# EAGLE design Corner Board Rev1 (EAGLE 9.6.2)
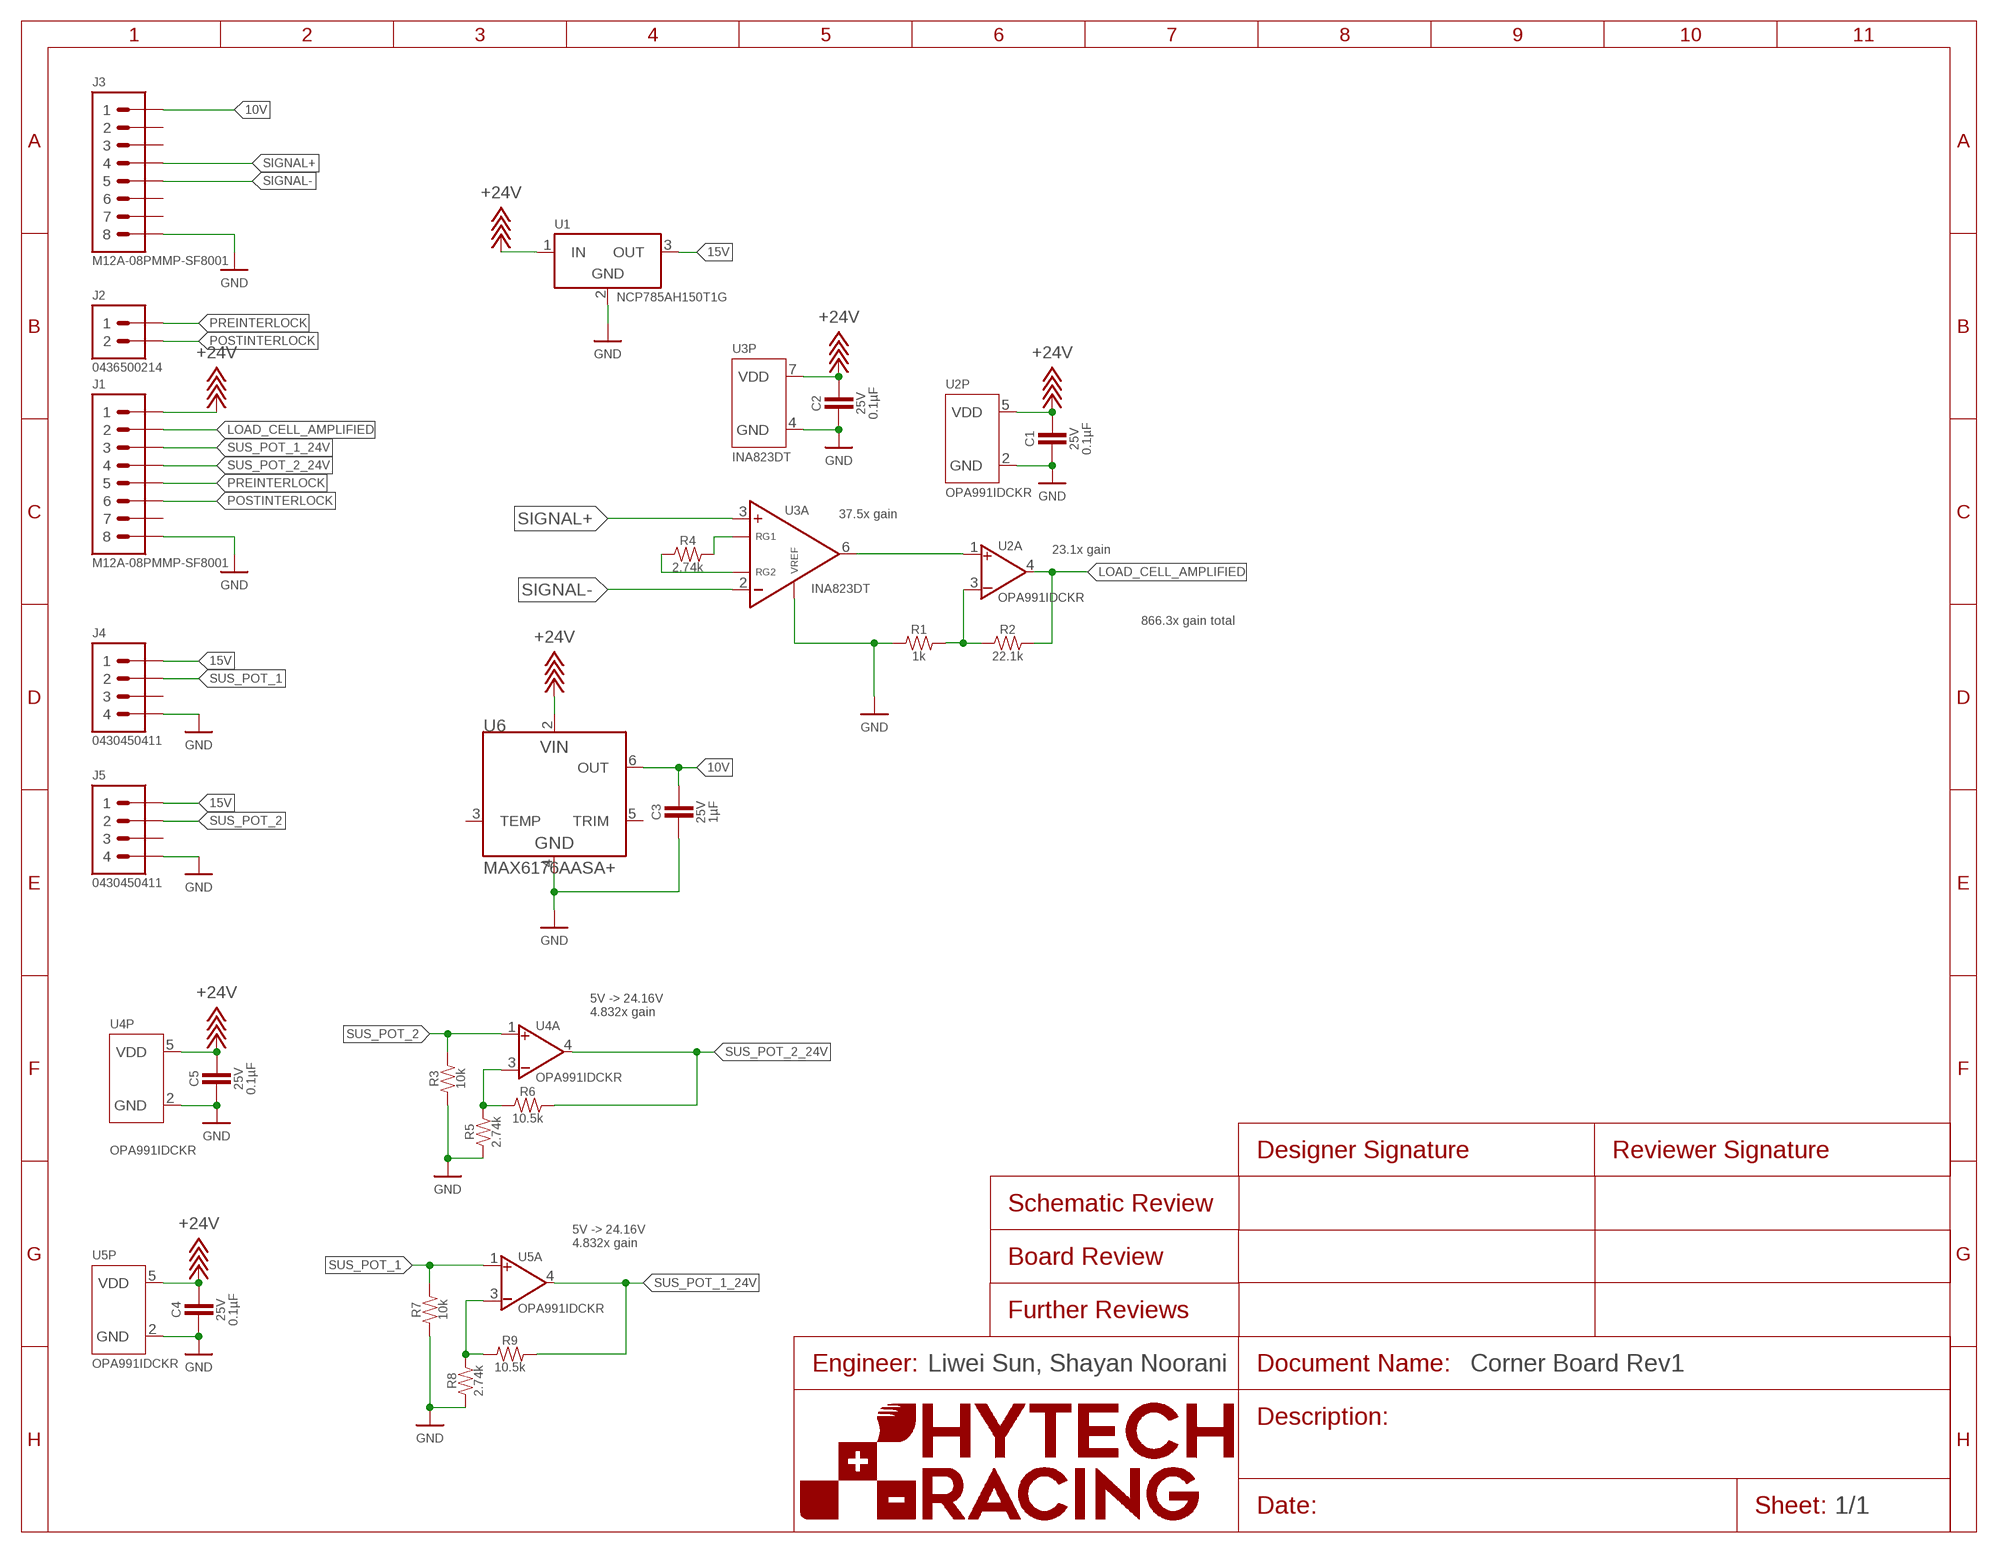
[diagram p0: schematic, sheet 1]
FRAME1 (FRAME): ENGINEER: Liwei Sun, Shayan Noorani

## Parts
C1  CAPACITOR_0603_25V_0.1UF  [0603-CAP]
C2  CAPACITOR_0603_25V_0.1UF  [0603-CAP]
C3  CAPACITOR_0603_25V_1UF  [0603-CAP]
C4  CAPACITOR_0603_25V_0.1UF  [0603-CAP]
C5  CAPACITOR_0603_25V_0.1UF  [0603-CAP]
J1  CONNECTOR-8_AMPHENOL_M12A_08PMMP_  [M12A-08PMMP]
J2  CONNECTOR-2_MICROFIT_SMD_RIGHTANGLE_02_SINGLE_BLACK  [MOLEX_MICROFIT_SMD_RIGHTANGLE_02_SINGLE]
J3  CONNECTOR-8_AMPHENOL_M12A_08PMMP_  [M12A-08PMMP]
J4  CONNECTOR-4_μF_S_RA_  [MOLEX_MICROFIT_SMD_RIGHTANGLE_04_DUAL]
J5  CONNECTOR-4_μF_S_RA_  [MOLEX_MICROFIT_SMD_RIGHTANGLE_04_DUAL]
R1  RESISTOR_0603_1K  [0603-RES]
R2  RESISTOR_0603_22.1K  [0603-RES]
R3  RESISTOR_0603_10K  [0603-RES]
R4  RESISTOR_0603_2.74K  [0603-RES]
R5  RESISTOR_0603_2.74K  [0603-RES]
R6  RESISTOR_0603_10.5K  [0603-RES]
R7  RESISTOR_0603_10K  [0603-RES]
R8  RESISTOR_0603_2.74K  [0603-RES]
R9  RESISTOR_0603_10.5K  [0603-RES]
U1  VOLTAGE_REGULATOR_SOT-89_15V  [SOT-89]
U2  OPAMP_1_CHANNEL_OPA991  [SC-70-5]
U3  INA823DT  [SOIC-08(NARROW,0.15")]
U4  OPAMP_1_CHANNEL_OPA991  [SC-70-5]
U5  OPAMP_1_CHANNEL_OPA991  [SC-70-5]
U6  VOLTAGE_REFERENCE__10V  [SOIC-08(NARROW,0.15")]

## Nets
10V: C3.1 J3.1 U6.6(OUT)
15V: J4.1 J5.1 U1.3(OUT)
+24V: C1.1 C2.1 C4.1 C5.1 J1.1 U1.1(IN) U2.5(P:VDD) U3.7(P:VDD) U4.5(P:VDD) U5.5(P:VDD) U6.2(VIN)
GND: C1.2 C2.2 C3.2 C4.2 C5.2 J1.8 J3.8 J4.4 J5.4 R1.1 R3.1 R5.1 U1.2(GND) U2.2(P:GND) U3.4(P:GND) U3.5(A:VREF) U4.2(P:GND) U5.2(P:GND) U6.4(GND)
LOAD_CELL_AMPLIFIED: J1.2 R2.2 U2.4(A:VOUT)
N$1: R1.2 R2.1 U2.3(A:VIN-)
N$2: R4.2 U3.1(A:RG1)
N$3: U2.1(A:VIN+) U3.6(A:VOUT)
N$4: R4.1 U3.8(A:RG2)
N$5: R5.2 R6.1 U4.3(A:VIN-)
N$7: R7.1 R8.1 ; supply symbol labelled GND
N$8: R8.2 R9.1 U5.3(A:VIN-)
POSTINTERLOCK: J1.6 J2.2
PREINTERLOCK: J1.5 J2.1
SIGNAL+: J3.4 U3.3(A:VIN+)
SIGNAL-: J3.5 U3.2(A:VIN-)
SUS_POT_1: J4.2 R7.2 U5.1(A:VIN+)
SUS_POT_1_24V: J1.3 R9.2 U5.4(A:VOUT)
SUS_POT_2: J5.2 R3.2 U4.1(A:VIN+)
SUS_POT_2_24V: J1.4 R6.2 U4.4(A:VOUT)
Unconnected: J1.7 J3.2 J3.3 J3.6 J3.7 J4.3 J5.3 U6.3(TEMP) U6.5(TRIM)

## Notes on the sheet
- 37.5x gain
- 23.1x gain
- 866.3x gain total
- 5V -> 24.16V
  4.832x gain
- 5V -> 24.16V
  4.832x gain

## Library data of the parts
C1 C2 C4 C5 = HyTechDevices:CAPACITOR_?_*: Capacitor, Non-Polarized VJ...1BC Series Datasheet <https://www.mouser.com/datasheet/2/427/vjw1bcbascomseries-1762447.pdf> Samsung Datasheet <https://www.mouser.com/datasheet/2/585/MLCC-1837944.pdf> Walsin Datasheet <https://www.mouser.com/datasheet/2/210/WTC_MLCC_General_Purpose-1534899.pdf> GRM188R61A226ME15D <https://www.mouser.com/datasheet/2/281/1/GRM188R61A226ME15_02A-1985787.pdf> GRM188R61E106MA73D <https://www.mouser.com/datasheet/2/281/1/GRM188R61E106MA73_01A-1985806.pdf> 885012006013 <https://www.mouser.com/datasheet/2/445/885012006013-1726946.pdf> 2220Y6300105KXTWS2 <https://www.mouser.com/datasheet/2/218/SMD_High_and_Std_StackiCap_P62-1825512.pdf> Yageo Class 2, X5R <https://www.mouser.com/datasheet/2/447/UPY_GPHC_X5R_4V_to_50V_26-1827097.pdf> TDK C Series <https://www.mouser.com/ProductDetail/TDK/C3216X5R1V226M160AC?qs=%2Fha2pyFadujbcx9jh7lYl%2F4NeMoXFhdc8AqVWNq4wW6M2y7zl6GzBuhgtI0ngznN> AVX Automotive MLCC <https://www.mouser.com/datasheet/2/40/AutoMLCC-777028.pdf> KEMET X7R Series <https://www.mouser.com/datasheet/2/212/KEM_C1002_X7R_SMD-1102033.pdf> Kyocera AVX <https://www.mouser.com/datasheet/2/40/C0GNP0_Dielectric-951274.pdf> GRM21BR61H <https://www.mouser.com/datasheet/2/281/1/GRM21BR61H106KE43_01A-1986884.pdf>; CAPACITANCE: 0.1µF; DKPN: 1276-1006-1-ND; MANUFACTURER: Samsung Electro-Mechanics; MOPN: 187-CL10B104KA8NNNC; MPN: CL10B104KA8NNNC; TOLERANCE: 10%; VOLTAGE: 25V
C3 = HyTechDevices:CAPACITOR_?_*: Capacitor, Non-Polarized VJ...1BC Series Datasheet <https://www.mouser.com/datasheet/2/427/vjw1bcbascomseries-1762447.pdf> Samsung Datasheet <https://www.mouser.com/datasheet/2/585/MLCC-1837944.pdf> Walsin Datasheet <https://www.mouser.com/datasheet/2/210/WTC_MLCC_General_Purpose-1534899.pdf> GRM188R61A226ME15D <https://www.mouser.com/datasheet/2/281/1/GRM188R61A226ME15_02A-1985787.pdf> GRM188R61E106MA73D <https://www.mouser.com/datasheet/2/281/1/GRM188R61E106MA73_01A-1985806.pdf> 885012006013 <https://www.mouser.com/datasheet/2/445/885012006013-1726946.pdf> 2220Y6300105KXTWS2 <https://www.mouser.com/datasheet/2/218/SMD_High_and_Std_StackiCap_P62-1825512.pdf> Yageo Class 2, X5R <https://www.mouser.com/datasheet/2/447/UPY_GPHC_X5R_4V_to_50V_26-1827097.pdf> TDK C Series <https://www.mouser.com/ProductDetail/TDK/C3216X5R1V226M160AC?qs=%2Fha2pyFadujbcx9jh7lYl%2F4NeMoXFhdc8AqVWNq4wW6M2y7zl6GzBuhgtI0ngznN> AVX Automotive MLCC <https://www.mouser.com/datasheet/2/40/AutoMLCC-777028.pdf> KEMET X7R Series <https://www.mouser.com/datasheet/2/212/KEM_C1002_X7R_SMD-1102033.pdf> Kyocera AVX <https://www.mouser.com/datasheet/2/40/C0GNP0_Dielectric-951274.pdf> GRM21BR61H <https://www.mouser.com/datasheet/2/281/1/GRM21BR61H106KE43_01A-1986884.pdf>; CAPACITANCE: 1µF; DKPN: 1276-1184-1-ND; MANUFACTURER: Samsung Electro-Mechanics; MOPN: 187-CL10B105KA8NNNC; MPN: CL10B105KA8NNNC; TOLERANCE: 10%; VOLTAGE: 25V
J1 J3 = HyTechDevices:CONNECTOR-8_?_*: 8 Pin Connector; DKPN: 1754-1026-ND; MANUFACTURER: Amphenol LTW; MOPN: 523-M12A08PMMPSF8001; MPN: M12A-08PMMP-SF8001
J2 = HyTechDevices:CONNECTOR-2_?_*: 2 Pin Connector; DKPN: WM14310CT-ND; MANUFACTURER: Molex; MOPN: 538-43650-0214; MPN: 0436500214
J4 J5 = HyTechDevices:CONNECTOR-4_?_*: 4 Pin Connector; DKPN: WM1832CT-ND; MANUFACTURER: Molex; MOPN: 538-0430450411; MPN: 0430450411
R1 = HyTechDevices:RESISTOR_?_*: Resistor PWR163 Series <https://www.mouser.com/datasheet/2/54/pwr163-777985.pdf> AC Series <https://www.mouser.com/datasheet/2/447/Yageo_PYu_AC_51_RoHS_L_7_1714230-1874691.pdf> PU Series <https://www.mouser.com/datasheet/2/447/PYu-PU_51_RoHS_L_6-1504619.pdf> ERA Series <https://www.mouser.com/datasheet/2/315/AOA0000C307-1149632.pdf> PWR263 Series <https://www.mouser.com/datasheet/2/54/pwr263s_35-778069.pdf> KTR Series <https://www.mouser.com/datasheet/2/348/ROHM_S_A0011075115_1-2563276.pdf> RC Series <https://www.mouser.com/datasheet/2/447/Yageo_03_18_2021_PYu_RC_Group_51_RoHS_L_11-2199992.pdf> ERJ PB3, PB6 Series <https://www.mouser.com/datasheet/2/315/AOA0000C328-1530132.pdf> ERJ PA2, P03, PA3, P06, P08, P14 Series <https://www.mouser.com/datasheet/2/315/AOA0000C331-1141874.pdf> B20 Series <https://www.ohmite.com/assets/docs/res_200.pdf?r=false> TE Connectivity/Holsworthy RN73 Series <https://www.mouser.com/datasheet/2/418/4/NG_DS_1773270_M-604713.pdf> Vishay Dale D/CRCW e3 <https://www.mouser.com/datasheet/2/427/dcrcwe3-1762152.pdf> Ohmite B20 <https://www.ohmite.com/assets/docs/res_200.pdf?r=false>; DKPN: 1712-CPF-A-0603B1K0ETR-ND; MANUFACTURER: TE Connectivity Passive Product; MOPN: 279-CPF-A-0603B1K0E; MPN: CPF-A-0603B1K0E; POWER: 0.0625W; RESISTANCE: 1k; TOLERANCE: 0.1%; VOLTAGE_CONTINUOUS: 7.9V; VOLTAGE_MAX: 50V
R2 = HyTechDevices:RESISTOR_?_*: Resistor PWR163 Series <https://www.mouser.com/datasheet/2/54/pwr163-777985.pdf> AC Series <https://www.mouser.com/datasheet/2/447/Yageo_PYu_AC_51_RoHS_L_7_1714230-1874691.pdf> PU Series <https://www.mouser.com/datasheet/2/447/PYu-PU_51_RoHS_L_6-1504619.pdf> ERA Series <https://www.mouser.com/datasheet/2/315/AOA0000C307-1149632.pdf> PWR263 Series <https://www.mouser.com/datasheet/2/54/pwr263s_35-778069.pdf> KTR Series <https://www.mouser.com/datasheet/2/348/ROHM_S_A0011075115_1-2563276.pdf> RC Series <https://www.mouser.com/datasheet/2/447/Yageo_03_18_2021_PYu_RC_Group_51_RoHS_L_11-2199992.pdf> ERJ PB3, PB6 Series <https://www.mouser.com/datasheet/2/315/AOA0000C328-1530132.pdf> ERJ PA2, P03, PA3, P06, P08, P14 Series <https://www.mouser.com/datasheet/2/315/AOA0000C331-1141874.pdf> B20 Series <https://www.ohmite.com/assets/docs/res_200.pdf?r=false> TE Connectivity/Holsworthy RN73 Series <https://www.mouser.com/datasheet/2/418/4/NG_DS_1773270_M-604713.pdf> Vishay Dale D/CRCW e3 <https://www.mouser.com/datasheet/2/427/dcrcwe3-1762152.pdf> Ohmite B20 <https://www.ohmite.com/assets/docs/res_200.pdf?r=false>; DKPN: P22.1KDBCT-ND; MANUFACTURER: Panasonic Electronic Components; MOPN: 667-ERA-3AEB2212V; MPN: ERA-3AEB2212V; POWER: 0.1W; RESISTANCE: 22.1k; TOLERANCE: 0.1%; VOLTAGE_CONTINUOUS: 47.01V; VOLTAGE_MAX: 75V
R3 R7 = HyTechDevices:RESISTOR_?_*: Resistor PWR163 Series <https://www.mouser.com/datasheet/2/54/pwr163-777985.pdf> AC Series <https://www.mouser.com/datasheet/2/447/Yageo_PYu_AC_51_RoHS_L_7_1714230-1874691.pdf> PU Series <https://www.mouser.com/datasheet/2/447/PYu-PU_51_RoHS_L_6-1504619.pdf> ERA Series <https://www.mouser.com/datasheet/2/315/AOA0000C307-1149632.pdf> PWR263 Series <https://www.mouser.com/datasheet/2/54/pwr263s_35-778069.pdf> KTR Series <https://www.mouser.com/datasheet/2/348/ROHM_S_A0011075115_1-2563276.pdf> RC Series <https://www.mouser.com/datasheet/2/447/Yageo_03_18_2021_PYu_RC_Group_51_RoHS_L_11-2199992.pdf> ERJ PB3, PB6 Series <https://www.mouser.com/datasheet/2/315/AOA0000C328-1530132.pdf> ERJ PA2, P03, PA3, P06, P08, P14 Series <https://www.mouser.com/datasheet/2/315/AOA0000C331-1141874.pdf> B20 Series <https://www.ohmite.com/assets/docs/res_200.pdf?r=false> TE Connectivity/Holsworthy RN73 Series <https://www.mouser.com/datasheet/2/418/4/NG_DS_1773270_M-604713.pdf> Vishay Dale D/CRCW e3 <https://www.mouser.com/datasheet/2/427/dcrcwe3-1762152.pdf> Ohmite B20 <https://www.ohmite.com/assets/docs/res_200.pdf?r=false>; DKPN: 311-10.0KHRCT-ND; MANUFACTURER: Yageo; MOPN: 603-RC0603FR-0710KL; MPN: RC0603FR-0710KL; POWER: 0.1W; RESISTANCE: 10k; TOLERANCE: 1%; VOLTAGE_CONTINUOUS: 31.62V; VOLTAGE_MAX: 75V
R4 R5 R8 = HyTechDevices:RESISTOR_?_*: Resistor PWR163 Series <https://www.mouser.com/datasheet/2/54/pwr163-777985.pdf> AC Series <https://www.mouser.com/datasheet/2/447/Yageo_PYu_AC_51_RoHS_L_7_1714230-1874691.pdf> PU Series <https://www.mouser.com/datasheet/2/447/PYu-PU_51_RoHS_L_6-1504619.pdf> ERA Series <https://www.mouser.com/datasheet/2/315/AOA0000C307-1149632.pdf> PWR263 Series <https://www.mouser.com/datasheet/2/54/pwr263s_35-778069.pdf> KTR Series <https://www.mouser.com/datasheet/2/348/ROHM_S_A0011075115_1-2563276.pdf> RC Series <https://www.mouser.com/datasheet/2/447/Yageo_03_18_2021_PYu_RC_Group_51_RoHS_L_11-2199992.pdf> ERJ PB3, PB6 Series <https://www.mouser.com/datasheet/2/315/AOA0000C328-1530132.pdf> ERJ PA2, P03, PA3, P06, P08, P14 Series <https://www.mouser.com/datasheet/2/315/AOA0000C331-1141874.pdf> B20 Series <https://www.ohmite.com/assets/docs/res_200.pdf?r=false> TE Connectivity/Holsworthy RN73 Series <https://www.mouser.com/datasheet/2/418/4/NG_DS_1773270_M-604713.pdf> Vishay Dale D/CRCW e3 <https://www.mouser.com/datasheet/2/427/dcrcwe3-1762152.pdf> Ohmite B20 <https://www.ohmite.com/assets/docs/res_200.pdf?r=false>; DKPN: P20020CT-ND; MANUFACTURER: Panasonic Electronic Components; MOPN: 667-ERJ-PB3B2741V; MPN: ERJ-PB3B2741V; POWER: 0.2W; RESISTANCE: 2.74k; TOLERANCE: 0.1%; VOLTAGE_CONTINUOUS: 23.41V; VOLTAGE_MAX: 150V
R6 R9 = HyTechDevices:RESISTOR_?_*: Resistor PWR163 Series <https://www.mouser.com/datasheet/2/54/pwr163-777985.pdf> AC Series <https://www.mouser.com/datasheet/2/447/Yageo_PYu_AC_51_RoHS_L_7_1714230-1874691.pdf> PU Series <https://www.mouser.com/datasheet/2/447/PYu-PU_51_RoHS_L_6-1504619.pdf> ERA Series <https://www.mouser.com/datasheet/2/315/AOA0000C307-1149632.pdf> PWR263 Series <https://www.mouser.com/datasheet/2/54/pwr263s_35-778069.pdf> KTR Series <https://www.mouser.com/datasheet/2/348/ROHM_S_A0011075115_1-2563276.pdf> RC Series <https://www.mouser.com/datasheet/2/447/Yageo_03_18_2021_PYu_RC_Group_51_RoHS_L_11-2199992.pdf> ERJ PB3, PB6 Series <https://www.mouser.com/datasheet/2/315/AOA0000C328-1530132.pdf> ERJ PA2, P03, PA3, P06, P08, P14 Series <https://www.mouser.com/datasheet/2/315/AOA0000C331-1141874.pdf> B20 Series <https://www.ohmite.com/assets/docs/res_200.pdf?r=false> TE Connectivity/Holsworthy RN73 Series <https://www.mouser.com/datasheet/2/418/4/NG_DS_1773270_M-604713.pdf> Vishay Dale D/CRCW e3 <https://www.mouser.com/datasheet/2/427/dcrcwe3-1762152.pdf> Ohmite B20 <https://www.ohmite.com/assets/docs/res_200.pdf?r=false>; DKPN: P10.5KDBCT-ND; MANUFACTURER: Panasonic Electronic Components; MOPN: 677-ERA-3AEB1052V; MPN: ERA-3AEB1052V; POWER: 0.1W; RESISTANCE: 10.5k; TOLERANCE: 0.1%; VOLTAGE_CONTINUOUS: 32.40V; VOLTAGE_MAX: 75V
U1 = HyTechDevices:VOLTAGE_REGULATOR_?_*: Voltage Regulators LDL1117S50R Datasheet <https://www.mouser.com/datasheet/2/389/dm00366442-1799212.pdf> NCP785AH120T1G <https://www.mouser.com/datasheet/2/308/NCP785A_D-1812704.pdf> LMS8117A Datasheet <https://www.ti.com/lit/ds/symlink/lms8117a.pdf?HQS> ST732M50R Datasheet <https://www.mouser.com/datasheet/2/389/st732-1830546.pdf> LM2937IMPX-10/NOPB Datasheet <https://www.ti.com/lit/ds/symlink/lm2937.pdf>; DKPN: NCP785AH150T1GOSTR-ND; MANUFACTURER: ON Semiconductor; MOPN: 863-NCP785AH150T1G; MPN: NCP785AH150T1G
U2 U4 U5 = HyTechDevices:OPAMP_1_CHANNEL_*: Op-Amp 1 Channel OPA991 Datasheet <https://www.ti.com/lit/ds/symlink/opa991.pdf?ts=1615503614502> Note: OPA991 is also a comparator; DKPN: 296-OPA991IDCKRCT-ND; MANUFACTURER: Texas Instruments; MOPN: 595-OPA991IDCKR; MPN: OPA991IDCKR
U3 = HyTechDevices:INA823*: INA823 Precision, Low-Power, Wide-Supply (2.7-V to 36-V) Instrumentation Amplifier Datasheet <https://www.ti.com/lit/ds/symlink/ina823.pdf?HQS=dis-mous-null-mousermode-dsf-pf-null-wwe&ts=1664732413637&ref_url=https%253A%252F%252Fwww.ti.com%252Fgeneral%252Fdocs%252Fsuppproductinfo.tsp%253FdistId%253D26%2526gotoUrl%253Dhttps%253A%252F%252Fwww.ti.com%252Flit%252Fgpn%252Fina823>; DKPN: 296-INA823DTCT-ND; MANUFACTURER: Texas Instruments; MOPN: 595-INA823DT; MPN: INA823DT
U6 = temp:VOLTAGE_REFERENCE_?_*: MAX6173–MAX6177 Datasheet <https://www.mouser.com/datasheet/2/256/MAX6173-MAX6177-1515925.pdf>; DKPN: MAX6176AASA+-ND; MANUFACTURER: Maxim Integrated; MOPN: 700-MAX6176AASA; MPN: MAX6176AASA+

## Board
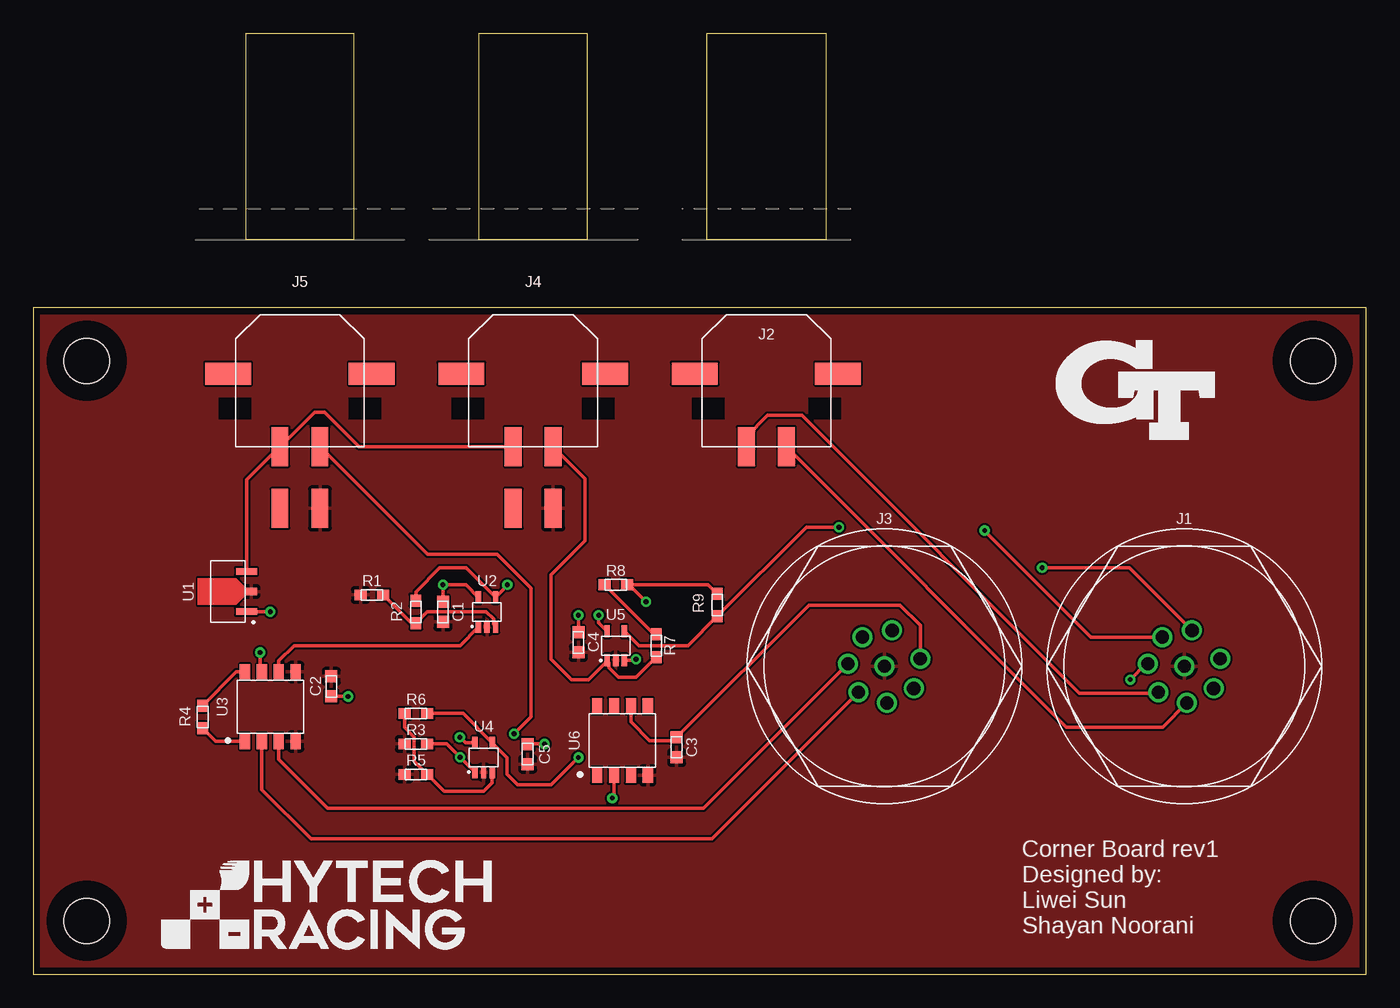
[diagram p1: board, top side]
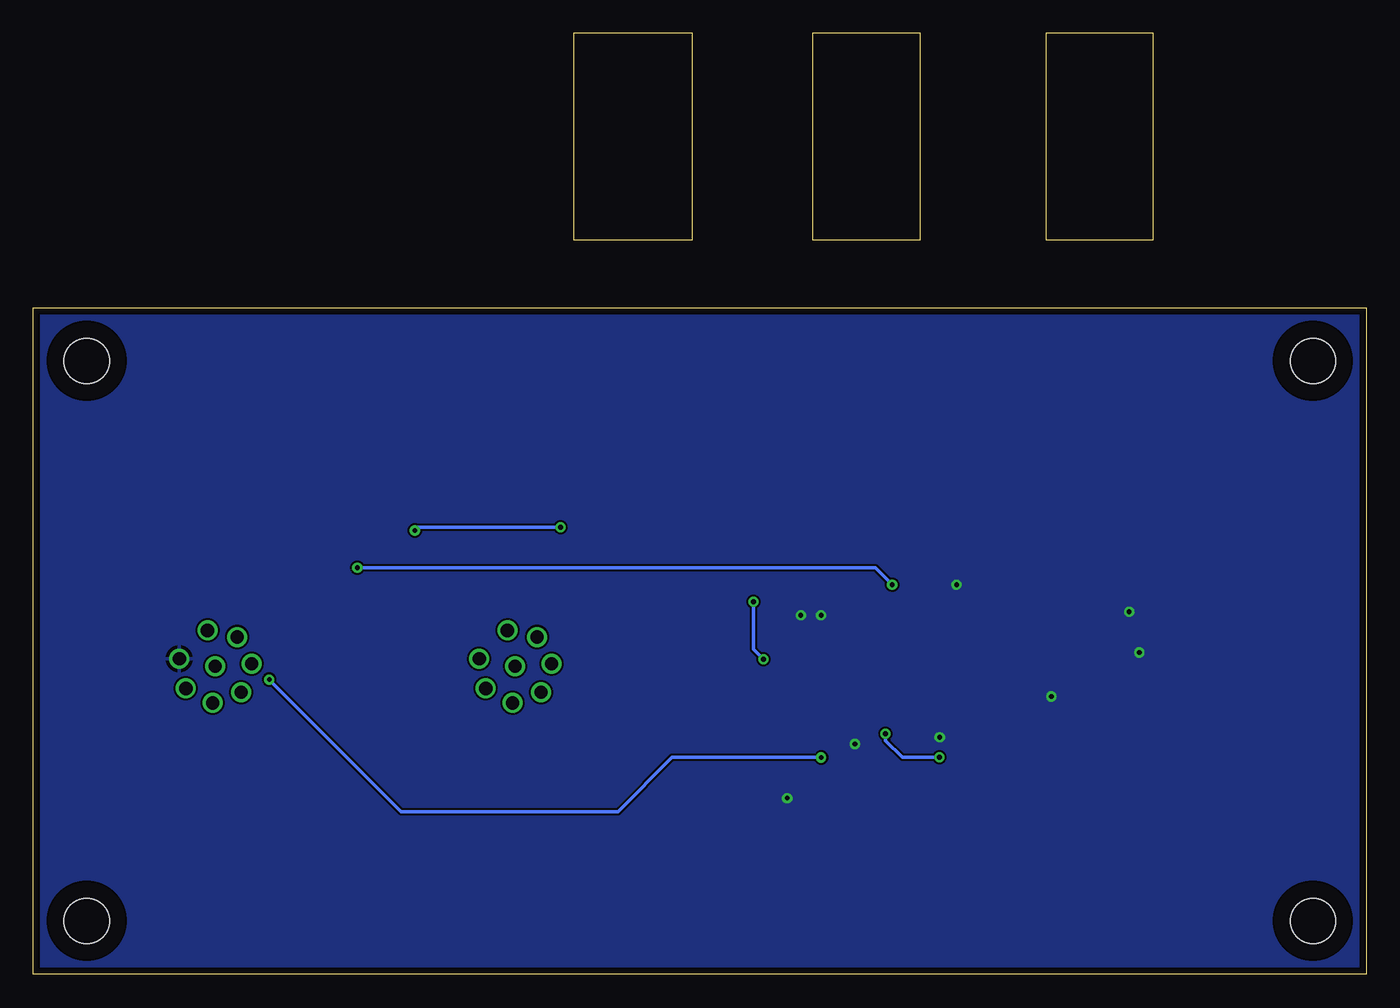
[diagram p2: board, bottom side, seen from below]

Size 100 x 50 mm. Coordinates in mm from the lower left corner, seen from the top.
Outline: 0,0 100,0 100,50 0,50 0,0
Copper layers (1*16): Top 0.035mm / dielectric 1.53mm / Bottom 0.035mm
Design rules "HyTech Default (2 Layer)": minimum track width 6mil, minimum drill 14mil, track to track 6mil, track to pad 6mil, pad to pad 6mil, via to via 20mil, smd to smd 6mil, copper to edge 20mil, drill to drill 21mil, minimum pad ring 7mil, minimum via ring 8mil, stop-mask expansion 6mil, vias tented up to drill 30mil, thermal gap 10mil

### Footprints (pad centres in the part's own frame; a part is rotated, then mirrored left to right if it is on the bottom)
0603-CAP = smd 0.9 x 0.9: 1 -0.75,0; 2 0.75,0
M12A-08PMMP = drill 1: 1 2.69,0.572; 2 0.572,2.69; 3 -1.655,2.196; 4 -2.743,0.192; 5 -1.945,-1.945; 6 0.192,-2.743; 7 2.196,-1.655; 8 0,0
MOLEX_MICROFIT_SMD_RIGHTANGLE_02_SINGLE = smd 1.27 x 2.921: 1 1.499,5.474; 2 -1.499,5.474 | smd 3.429 x 1.651: PAD1 5.372,0; PAD2 -5.372,0
MOLEX_MICROFIT_SMD_RIGHTANGLE_04_DUAL = smd 1.27 x 2.921: 1 1.5,5.474; 2 -1.5,5.474; 3 1.5,10.097; 4 -1.5,10.097 | smd 3.429 x 1.651: PAD1 5.386,0; PAD2 -5.386,0
0603-RES = smd 0.9 x 0.8: 1 -0.85,0; 2 0.85,0
SOT-89 = smd 0.5 x 1.57: 1 -1.5,0; 3 1.5,0 | smd 0.58 x 0.86: 2 0,-0.355
SC-70-5 = smd 0.4 x 0.9: 1 -0.65,-1.1; 2 0,-1.1; 3 0.65,-1.1; 4 0.65,1.1; 5 -0.65,1.1
SOIC-08(NARROW,0.15") = smd 0.762 x 1.143: 1 -1.905,-2.603; 2 -0.635,-2.603; 3 0.635,-2.603; 4 1.905,-2.603; 5 1.905,2.603; 6 0.635,2.603; 7 -0.635,2.603; 8 -1.905,2.603
MOUNTING_M3 = hole 3.4: 0,0

### Placement (x,y rotation side)
C1  30.73,27.18 270 top
C2  22.35,21.59 90 top
C3  48.26,17.02 270 top
C4  40.89,24.89 270 top
C5  37.08,16.51 270 top
J1  86.36,23.09 0 top
J2  55,45.04 180 top
J3  63.86,23.09 0 top
J4  37.5,45.04 180 top
J5  20,45.04 180 top
R1  25.4,28.45 0 top
R2  28.7,27.18 90 top
R3  28.7,17.27 0 top
R4  12.7,19.3 270 top
R5  28.7,14.99 0 top
R6  28.7,19.56 0 top
R7  46.74,24.64 270 top
R8  43.69,29.21 0 top
R9  51.31,27.69 270 top
U1  16,28.7 90 top
U2  34.04,27.18 0 top
U3  17.78,20.07 0 top
U4  33.78,16.26 0 top
U5  43.69,24.64 0 top
U6  44.2,17.53 0 top
U$7  [MOUNTING_M3]  4,46 0 top
U$8  [MOUNTING_M3]  96,46 0 top
U$9  [MOUNTING_M3]  96,4 0 top
U$10  [MOUNTING_M3]  4,4 0 top
U$13  [LOGO_HYTECH_MEDIUM]  9.53,1.91 0 top
U$14  [LOGO_GT_MEDIUM]  82.68,43.81 0 top

### Tracks (layer width: path | path; a pad name or v marks a point on that pad's centre or on a via)
10V
  Top 0.254: U6.6 44.83,18.92 46.23,17.53 48.02,17.53 C3.1 58.18,27.69 65.02,27.69 66.55,26.16 J3.1
15V
  Top 0.254: U1.3 16,37.07 18.42,39.49 J5.1 21.1,42.16 21.84,42.16 24.44,39.57 J4.1
+24V  (via drill 0.36)
  Top 0.254: C1.1 v30.73,29.21 32.45,29.21 U2.5 | U5.5 42.42,26.36 v42.42,26.92 | U4.5 32.43,17.36 v32,17.78 | C5.1 37.1,17.27 v38.35,17.27 | C2.1 v23.61,20.84 v23.62,20.83 | U1.1 17.76,27.2 v17.78,27.18 | U3.7 17.02,22.8 v17.02,24.13 | U6.2 43.56,13.34 v43.43,13.21 | C4.1 v40.89,26.92
  pour Bottom: -0.25,50.55 -0.25,-0.25 100.58,-0.25 100.58,50.55
GND
  pour Top: -0.25,50.55 -0.25,-0.25 100.58,-0.25 100.58,50.55
LOAD_CELL_AMPLIFIED  (via drill 0.36)
  Top 0.254: v35.56,29.21 35.56,29.15 U2.4 32.48,30.48 30.48,30.48 28.7,28.7 R2.2 | v75.69,30.48 82.23,30.48 J1.2
  Bottom 0.254: v35.56,29.21 36.83,30.48 v75.69,30.48
N$1
  Top 0.254: R1.2 28.37,26.33 R2.1 29.55,27.18 33.98,27.18 34.52,26.64 34.52,26.25 U2.3
N$2
  Top 0.254: U3.1 13.69,17.46 R4.2
N$3
  Top 0.254: U3.6 18.41,23.5 19.56,24.64 32,24.64 33.39,26.02 U2.1
N$4
  Top 0.254: R4.1 15.22,22.67 U3.8
N$5
  Top 0.254: U4.3 34.43,14.37 33.78,13.72 30.82,13.72 R5.2 28.58,15.96 28.58,17.79 27.85,18.52 R6.1
N$7
  Top 0.254: R8.1 46.56,25.49 R7.1
N$8  (via drill 0.36)
  Top 0.254: R9.1 50.63,29.21 R8.2 44.7,29.21 v45.97,27.94 | U5.3 45.13,23.54 v45.21,23.62
  Bottom 0.254: v45.21,23.62 45.97,24.38 v45.97,27.94
POSTINTERLOCK
  Top 0.254: J2.2 77.52,18.54 84.74,18.54 J1.6
PREINTERLOCK
  Top 0.254: J2.1 53.5,40.33 55.08,41.91 57.66,41.91 78.49,21.08 84.34,21.08 J1.5
SIGNAL+
  Top 0.254: U3.3 18.41,16.13 22.1,12.45 50.27,12.45 J3.4
SIGNAL-
  Top 0.254: U3.2 17.14,13.84 20.83,10.16 50.92,10.16 J3.5
SUS_POT_1
  Top 0.254: R7.2 45.21,22.26 43.92,22.26 43.21,22.97 43.21,23.37 U5.1 43.04,23.48 41.66,22.1 40.39,22.1 38.86,23.62 38.86,29.97 41.4,32.51 41.4,37.16 J4.2
SUS_POT_1_24V  (via drill 0.36)
  Top 0.254: U5.4 45.44,24.64 49.11,24.64 R9.2 58,33.53 v60.45,33.53 | v71.37,33.27 79.36,25.29 J1.3
  Bottom 0.254: v60.45,33.53 71.12,33.53 v71.37,33.27
SUS_POT_2  (via drill 0.36)
  Top 0.254: R3.2 31.02,17.27 v32.02,16.27 U4.1 | J5.2 29.57,31.5 34.8,31.5 37.34,28.96 37.34,19.3 v36.07,18.03
  Bottom 0.254: v36.07,18.03 36.07,17.53 34.8,16.26 32.03,16.26 v32.02,16.27
SUS_POT_2_24V  (via drill 0.36)
  Top 0.254: R6.2 32.23,19.56 U4.4 35.56,16.23 35.56,14.99 36.32,14.22 38.86,14.22 v40.89,16.26 | v82.3,22.1 83.48,23.29 J1.4
  Bottom 0.254: v40.89,16.26 52.07,16.26 56.13,12.19 72.39,12.19 v82.3,22.1

### Text on the board
tPlace: Corner Board rev1 / Designed by: / Liwei Sun / Shayan Noorani